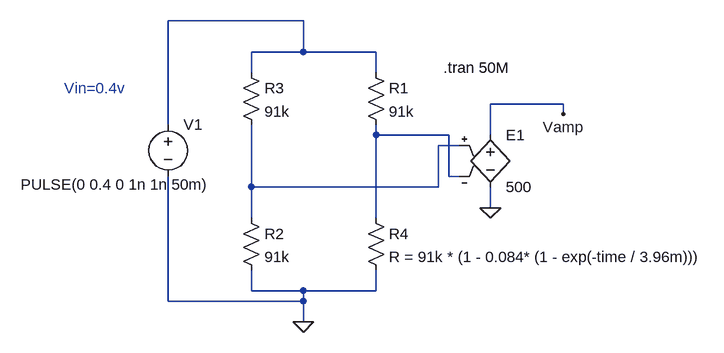
[diagram p0: schematic Micro_Bolometer_model.asc]
Micro_Bolometer_model.asc, the LTspice schematic file:
Version 4
SHEET 1 880 680
WIRE 128 -80 -80 -80
WIRE 128 -32 128 -80
WIRE 128 -32 48 -32
WIRE 240 -32 128 -32
WIRE 48 0 48 -32
WIRE 240 0 240 -32
WIRE 528 48 416 48
WIRE 528 64 528 48
WIRE -80 80 -80 -80
WIRE 240 96 240 80
WIRE 352 96 240 96
WIRE 416 96 416 48
WIRE 368 112 336 112
WIRE 352 160 352 96
WIRE 368 160 352 160
WIRE 48 176 48 80
WIRE 336 176 336 112
WIRE 336 176 48 176
WIRE 416 208 416 176
WIRE 48 224 48 176
WIRE 240 224 240 96
WIRE 48 336 48 304
WIRE 128 336 48 336
WIRE 240 336 240 304
WIRE 240 336 128 336
WIRE -80 352 -80 160
WIRE 128 352 128 336
WIRE 128 352 -80 352
WIRE 128 384 128 352
FLAG 128 384 0
FLAG 528 64 Vamp
FLAG 416 208 0
SYMBOL res 224 -16 R0
SYMATTR InstName R1
SYMATTR Value 91k
SYMBOL res 32 208 R0
SYMATTR InstName R2
SYMATTR Value 91k
SYMBOL res 32 -16 R0
SYMATTR InstName R3
SYMATTR Value 91k
SYMBOL voltage -80 64 R0
WINDOW 3 -227 108 Left 2
WINDOW 123 0 0 Left 0
WINDOW 39 0 0 Left 0
SYMATTR Value PULSE(0 0.4 0 1n 1n 50m)
SYMATTR InstName V1
SYMBOL res 224 208 R0
SYMATTR InstName R4
SYMATTR Value R = 91k * (1 - 0.084* (1 - exp(-time / 3.96m)))
SYMBOL e 416 80 R0
SYMATTR InstName E1
SYMATTR Value 500
TEXT 344 -8 Left 2 !.tran 50M
TEXT -240 24 Left 2 ;Vin=0.4v

The netlist it stands for:
* Micro_Bolometer_model.asc
R1 N001 N002 91k
R2 N003 0 91k
R3 N001 N003 91k
V1 N001 0 PULSE(0 0.4 0 1n 1n 50m)
R4 N002 0 R = 91k * (1 - 0.084* (1 - exp(-time / 3.96m)))
E1 Vamp 0 N003 N002 500
.tran 50M
* Vin=0.4v
.backanno
.end